# EAGLE design BHOnOfreSquareBoard (EAGLE 8.3.2)
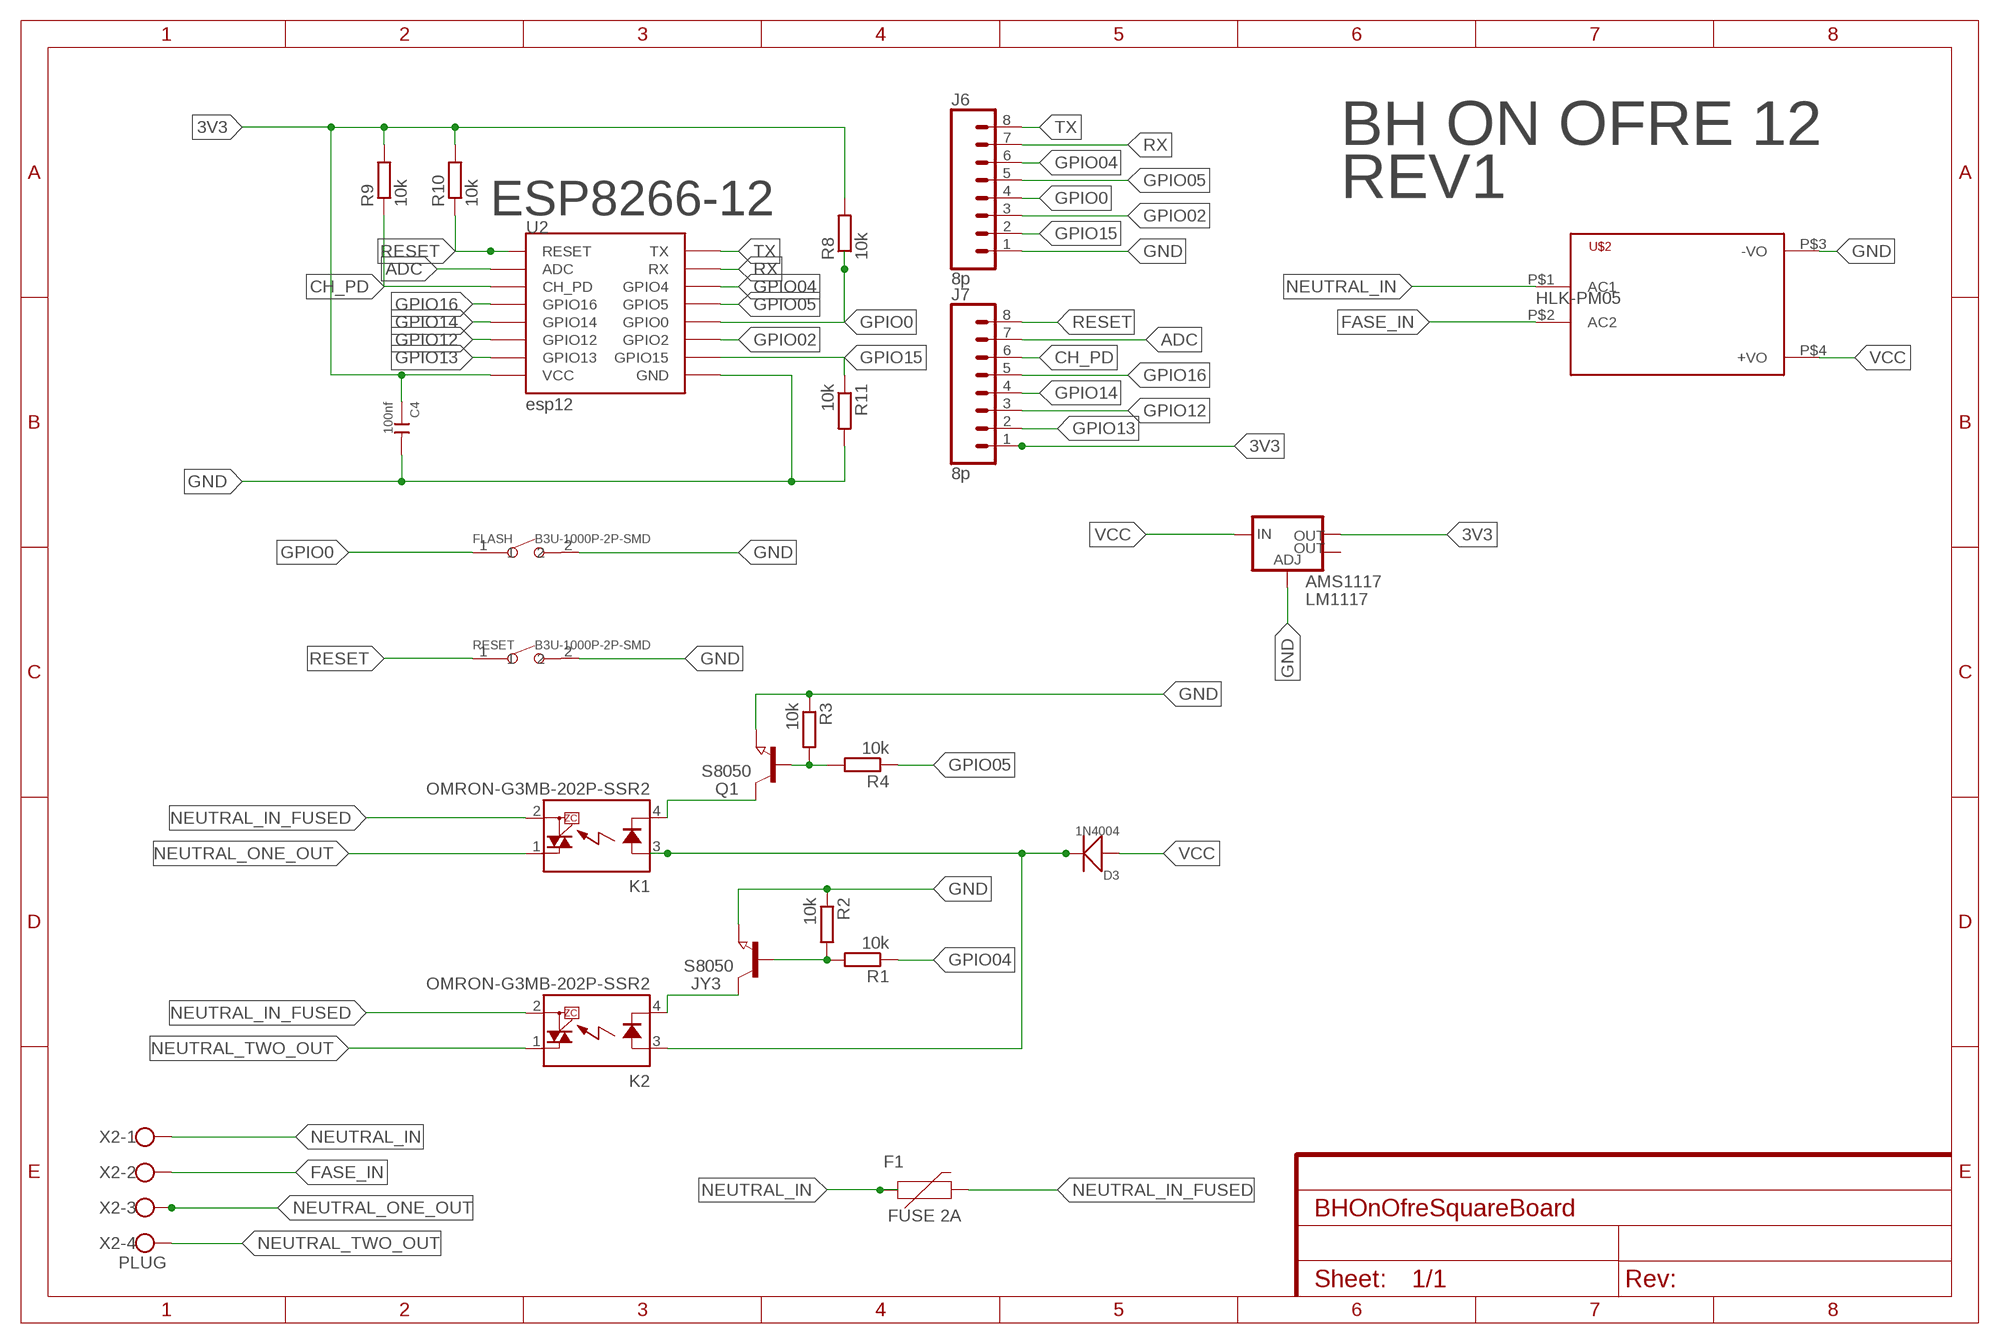
[diagram p0: schematic, sheet 1]

## Parts
AMS1117  LM1117  V_REG_LM1117SOT223  [SOT223]
C4  100nf  CERAMIC-100NF-50V-10%-X7R(0805)  [C0805]
D3  1N4004  DIODE-GEN-PURPOSE-1KV-1A(DO-214AC)  [DO-214AC]
F1  FUSE 2A  PPTC_PTH  [PTH]
FLASH  B3U-1000P-2P-SMD  SMD-BUTTON(2P-3.0X2.5X1.2+0.4MM)-B3U-1000P-2P-SMD  [SW2-2.6-3.0X2.5X1.2+0.4MM]
J6  8p  CONN_08"  [1X08]
J7  8p  CONN_08"  [1X08]
JY3  S8050  NPN-TRANSISTOR_SOT23  [SOT23]
K1  OMRON-G3MB-202P-SSR2  [OMRON-G3MB-202P-SSR]
K2  OMRON-G3MB-202P-SSR2  [OMRON-G3MB-202P-SSR]
Q1  S8050  NPN-TRANSISTOR_SOT23  [SOT23]
R1  10k  R-EU_R0603  [R0603]
R2  10k  R-EU_R0603  [R0603]
R3  10k  R-EU_R0603  [R0603]
R4  10k  R-EU_R0603  [R0603]
R8  10k  R-EU_R0603  [R0603]
R9  10k  R-EU_R0603  [R0603]
R10  10k  R-EU_R0603  [R0603]
R11  10k  R-EU_R0603  [R0603]
RESET  B3U-1000P-2P-SMD  SMD-BUTTON(2P-3.0X2.5X1.2+0.4MM)-B3U-1000P-2P-SMD  [SW2-2.6-3.0X2.5X1.2+0.4MM]
U2  esp12  ESP12SMD  [ESP12-SMD]
U$2  HKLPM01  [HKLPM01]
X2  PLUG  W237-4  [W237-4]

## Nets
3V3: AMS1117.2(OUT) C4.1 J7.1 R8.2 R9.2 R10.2 U2.VCC
ADC: J7.7 U2.ADC
CH_PD: J7.6 R9.1 U2.CH_PD
FASE_IN [220V]: U$2.P$2(AC2) X2.2
GND: AMS1117.1(ADJ) C4.2 FLASH.2 J6.1 JY3.2(E) Q1.2(E) R2.1 R3.1 R11.2 RESET.2 U2.GND U$2.P$3(-VO)
GPIO0: FLASH.1 J6.4 R8.1 U2.GPIO0
GPIO02: J6.3 U2.GPIO2
GPIO04: J6.6 R1.1 U2.GPIO4
GPIO05: J6.5 R4.1 U2.GPIO5
GPIO12: J7.3 U2.GPIO12
GPIO13: J7.2 U2.GPIO13
GPIO14: J7.4 U2.GPIO14
GPIO15: J6.2 R11.1 U2.GPIO15
GPIO16: J7.5 U2.GPIO16
N$1: K1.4(K) Q1.3(C)
N$2: D3.2(-) K1.3(A) K2.3(A)
N$7: Q1.1(B) R3.2 R4.2
N$9: JY3.3(C) K2.4(K)
N$13: JY3.1(B) R1.2 R2.2
NEUTRAL_IN [220V]: F1.P$1 U$2.P$1(AC1) X2.1
NEUTRAL_IN_FUSED: F1.P$2 K1.2(DS2) K2.2(DS2)
NEUTRAL_ONE_OUT [220V]: K1.1(DS1) X2.3
NEUTRAL_TWO_OUT [220V]: K2.1(DS1) X2.4
RESET: J7.8 R10.1 RESET.1 U2.RESET
RX: J6.7 U2.RXD0(RX)
TX: J6.8 U2.TXD0(TX)
VCC: AMS1117.3(IN) D3.1(+) U$2.P$4(+VO)
Unconnected: AMS1117.4(OUT)

## Notes on the sheet
- BH ON OFRE 12
- REV1
- ESP8266-12
- HLK-PM05

## Library data of the parts
AMS1117 = SparkFun-IC-Power:V_REG_LM1117: Voltage Regulator LM1117 Standard adjustable voltage regulator but in SMD form. Spark Fun Electronics SKU : COM-00595; PROD_ID: VREG-08170
C4 = Seeed-Capacitor:CERAMIC-100NF-50V-10%-X7R(0805): 302010165; MPN: CC0805KRX7R9BB104
D3 = Seeed-Diode:DIODE-GEN-PURPOSE-1KV-1A(DO-214AC): 304010013; MPN: 1N4007; VALUE: 1N4007
F1 = SparkFun-Fuses:PPTC: Resettable Fuse PPTC Resettable Fuse. Really a sort of resistor with a polymeric positive temperature coefficient whose resistance increases dramatically with an increase in temperature. When heated by the power passing through the resistance rises causing the current to be limited, protecting the circuit. This is achieved by the transition of the polymer from a crystalline to an amorphous state where the conductive carbon separates breaking the conductive pathways found in the cool crystalline structure. When a PPTC cools back down it resumes conducting letting the circuit turn back on. SparkFun Products: SparkFun RedBoard - Programmed with Arduino <https://www.sparkfun.com/products/12757> Pro Micro - 5V/16MHz <https://www.sparkfun.com/products/12640> Arduino Pro 328 - 5V/16MHz <https://www.sparkfun.com/products/10915> MP3 Trigger <https://www.sparkfun.com/products/13720>; PROD_ID: RES-08490; VALUE: 72V/0.25A
FLASH RESET = Seeed-Switch:SMD-BUTTON(2P-3.0X2.5X1.2+0.4MM): 311020047; MPN: B3U-1000P-2P-SMD
J6 J7 = SparkFun-Connectors:CONN_08: Multi connection point. Often used as Generic Header-pin footprint for 0.1 inch spaced/style header connections On any of the 0.1 inch spaced packages, you can populate with these: Break Away Headers - Straight <https://www.sparkfun.com/products/116> (PRT-00116) Break Away Male Headers - Right Angle <https://www.sparkfun.com/products/553> (PRT-00553) Female Headers <https://www.sparkfun.com/products/115> (PRT-00115) Break Away Headers - Machine Pin <https://www.sparkfun.com/products/117> (PRT-00117) Break Away Female Headers - Swiss Machine Pin <https://www.sparkfun.com/products/743> (PRT-00743) Arduino Stackable Header - 8 Pin <https://www.sparkfun.com/products/9279> (PRT-09279) For SCREWTERMINALS and SPRING TERMINALS visit here: Screw Terimnals on SparkFun.com <https://www.sparkfun.com/search/results?term=Screw+Terminals> (5mm/3.5mm/2.54mm spacing) This device is also useful as a general connection point to wire up your design to another part of your project. Our various solder wires solder well into these plated through hole pads. Hook-Up Wire - Assortment (Stranded, 22 AWG) <https://www.sparkfun.com/products/11375> (PRT-11375) Hook-Up Wire - Assortment (Solid Core, 22 AWG) <https://www.sparkfun.com/products/11367> (PRT-11367) View the entire wire category on our website here <https://www.sparkfun.com/categories/141> Special notes: Molex polarized connector foot print use with SKU : PRT-08231 with associated crimp pins and housings. 1MM SMD Version SKU: PRT-10208 NOTES ON THE VARIANTS LOCK and LOCK_LONGPADS... This footprint was designed to help hold the alignment of a through-hole component (i.e. 6-pin header) while soldering it into place. You may notice that each hole has been shifted either up or down by 0.005 of an inch from it's more standard position (which is a perfectly straight line). This slight alteration caused the pins (the squares in the middle) to touch the edges of the holes. Because they are alternating, it causes a "brace" to hold the component in place. 0.005 has proven to be the perfect amount of "off-center" position when using our standard breakaway headers. Although looks a little odd when you look at the bare footprint, once you have a header in there, the alteration is very hard to notice. Also,if you push a header all the way into place, it is covered up entirely on the bottom side.; PROD_ID: CONN-08438
JY3 Q1 = semicon-smd-ipc:NPN-TRANSISTOR_: NPN TRANSISTOR
K1 K2 = Omron G3MB 202p SSR:OMRON-G3MB-202P-SSR: IT(rms) 8A, Zero Cross type SIP 4pin Triac output SSR Source: http://sharp-world.com/products/device/lineup/data/pdf/datasheet/s102s02_e.pdf; MPN: S202S02F; OC_FARNELL: 1618475; OC_NEWARK: 14N9588
R1-R4 R8-R11 = resistor:R-EU_: RESISTOR, European symbol
U2 = esp8266modules:ESP12: ESP8266 Wifi module 12
U$2 = HKLPM01:HKLPM01
X2 = con-wago-500:W237-4: WAGO SCREW CLAMP; OC_FARNELL: unknown; OC_NEWARK: unknown

## Net classes
1 220V: width 1.27 mm, clearance 1 mm

## Board
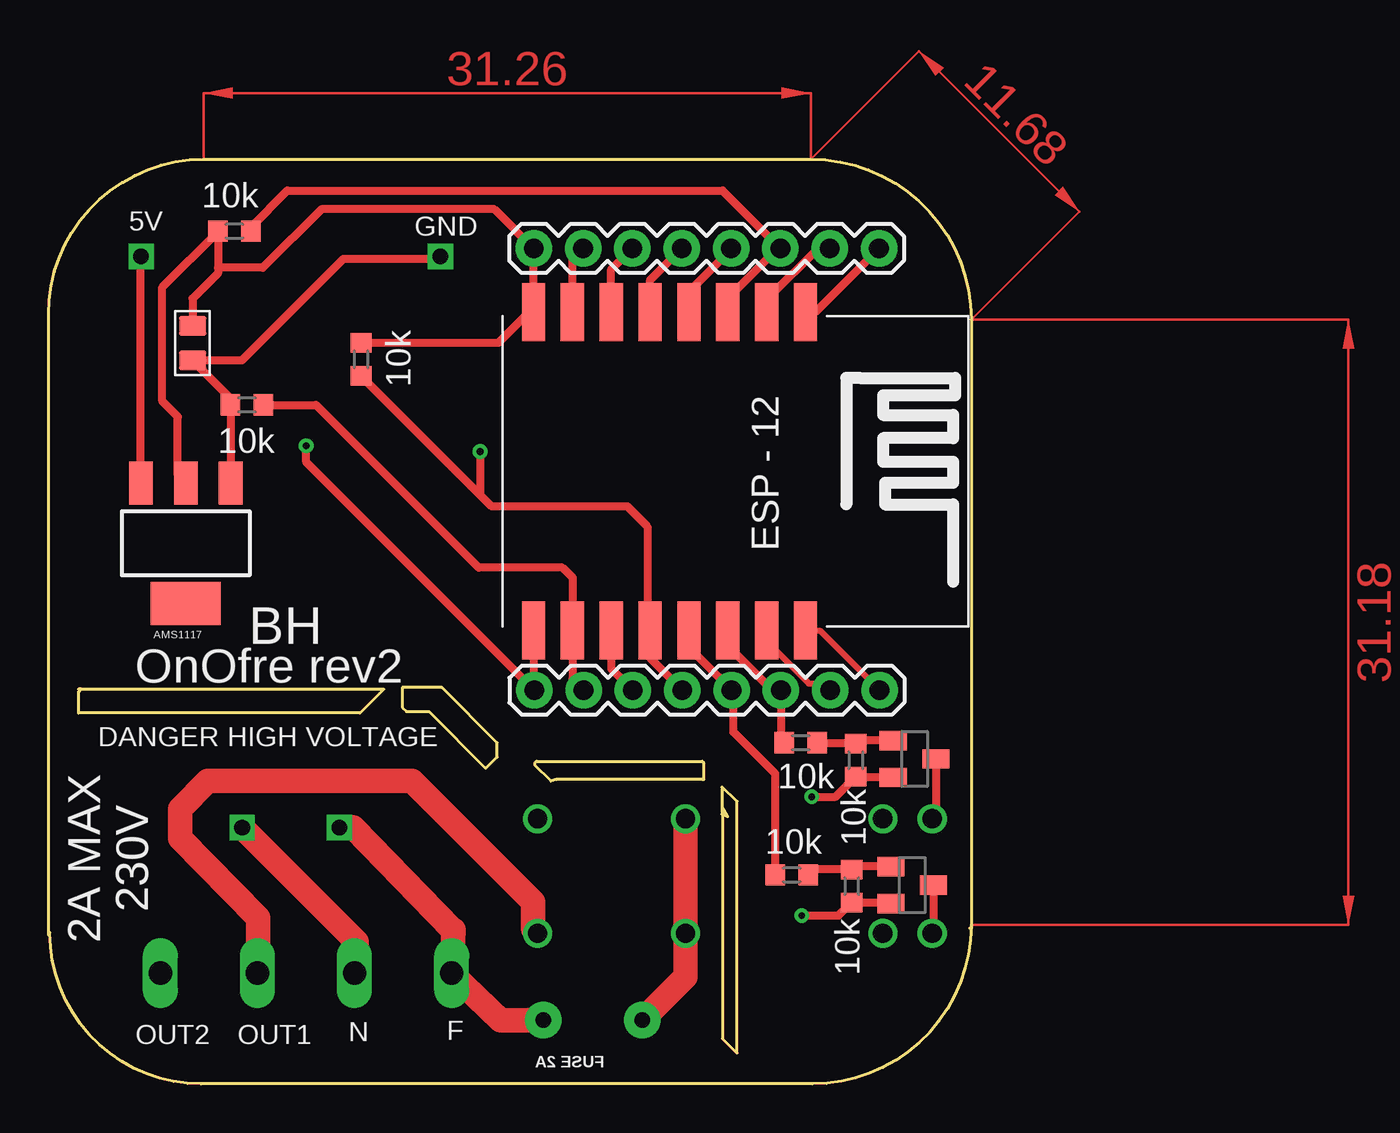
[diagram p1: board, top side]
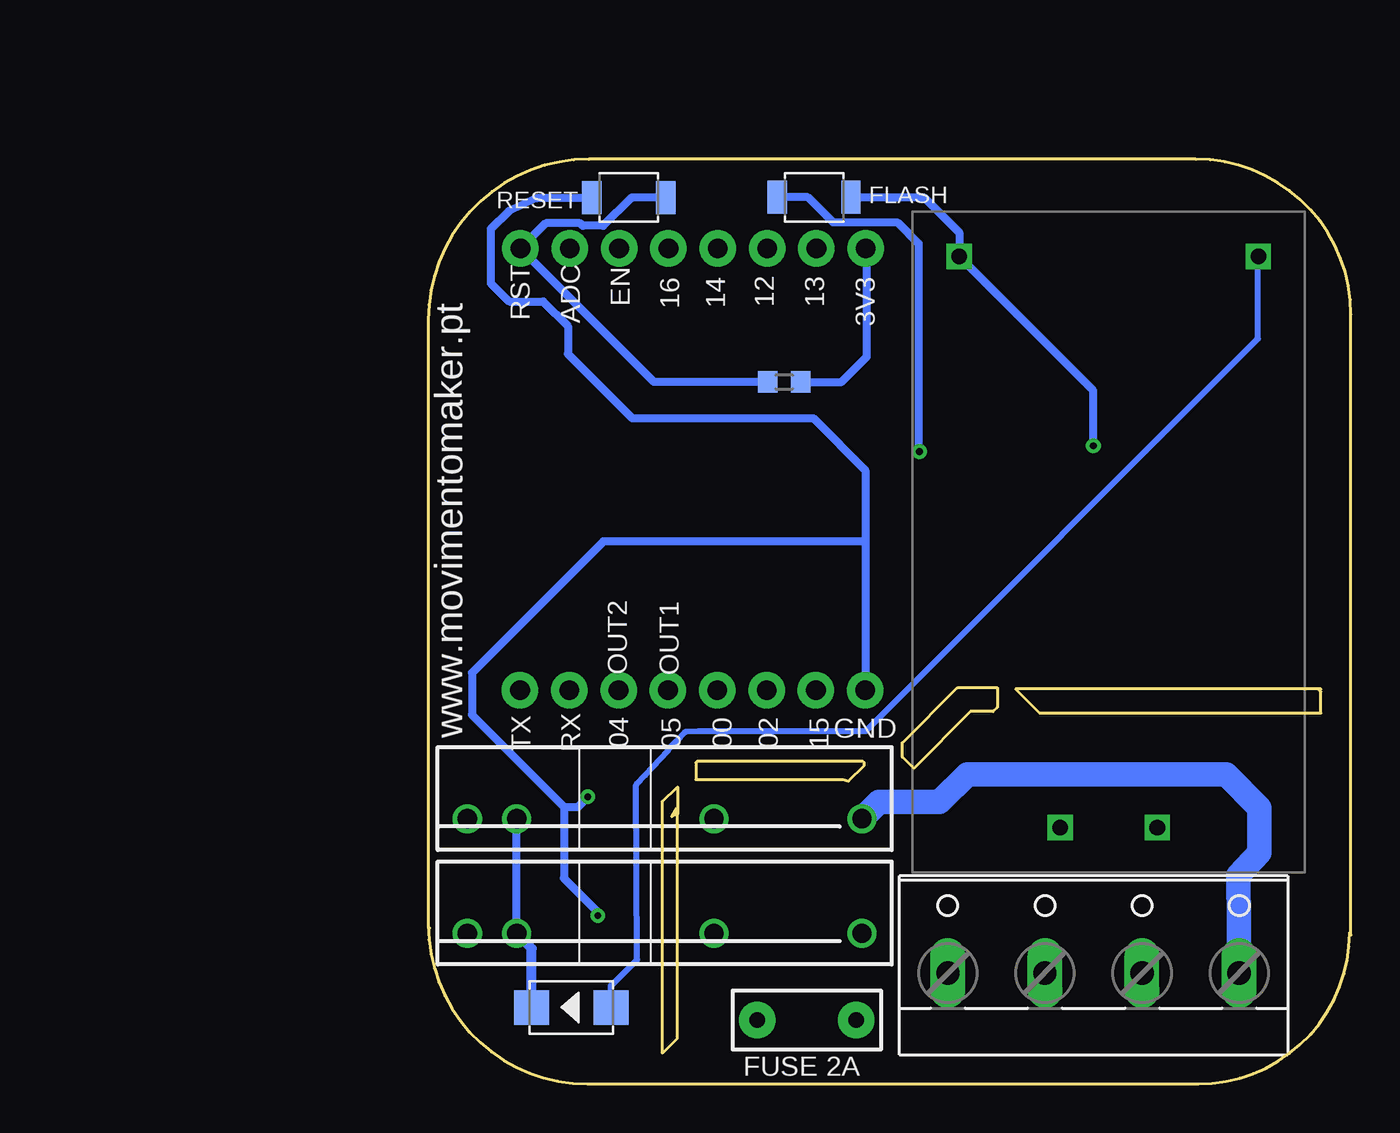
[diagram p2: board, bottom side, seen from below]

Size 47.51 x 47.62 mm. Coordinates in mm from the lower left corner, seen from the top.
Outline: 47.47,8 47.44,8.03
Outline: 0,7.66 0,39.63 arc-90 7.98,47.62 39.25,47.62 arc-90 47.51,39.36 47.51,8.18 arc-90 39.32,0 7.86,0 arc-90 0.07,7.79
Copper layers (1*16): Top 0.035mm / dielectric 1.5mm / Bottom 0.035mm
Design rules "default": minimum track width 6mil, minimum drill 0.35mm, track to track 6mil, track to pad 6mil, pad to pad 6mil, via to via 6mil, smd to smd 6mil, copper to edge 40mil, drill to drill 6mil, minimum pad ring 10mil, minimum via ring 8mil, stop-mask expansion 4mil, vias tented up to drill 0mil, thermal gap 10mil

### Footprints (pad centres in the part's own frame; a part is rotated, then mirrored left to right if it is on the bottom)
SOT223 = smd 1.219 x 2.235: 1 -2.311,-3.099; 2 0,-3.099; 3 2.311,-3.099 | smd 3.6 x 2.2: 4 0,3.099
C0805 = smd 1.397 x 1.016: 1 0,0.889; 2 0,-0.889
DO-214AC = smd 1.8 x 1.77: 1 -2.042,0; 2 2.042,0
PTH = drill 0.8 pad 1.88: P$1 -2.54,0; P$2 2.54,0
SW2-2.6-3.0X2.5X1.2+0.4MM = smd 1 x 1.7: 1 -1.9,0; 2 1.9,0
1X08 = drill 1.016 pad 1.88: 1 0,0; 2 2.54,0; 3 5.08,0; 4 7.62,0; 5 10.16,0; 6 12.7,0; 7 15.24,0; 8 17.78,0
SOT23 = smd 1 x 1.4: 1 -0.95,-1.1; 2 0.95,-1.1; 3 0,1.1
OMRON-G3MB-202P-SSR = drill 1: 1 -12.7,0; 2 -5.08,0; 3 5.08,0; 4 7.62,0
R0603 = smd 1 x 1.1: 1 -0.85,0; 2 0.85,0
ESP12-SMD = smd 3 x 1.2: ADC -8.3,3.8; CH_PD -8.3,1.8; GND 8.1,-8.2; GPIO0 8.1,-2.2; GPIO2 8.1,-4.2; GPIO4 8.1,1.8; GPIO5 8.1,-0.2; GPIO12 -8.3,-4.2; GPIO13 -8.3,-6.2; GPIO14 -8.3,-2.2; GPIO15 8.1,-6.2; GPIO16 -8.3,-0.2; RESET -8.3,5.8; RXD0 8.1,3.8; TXD0 8.1,5.8; VCC -8.3,-8.2
HKLPM01 = drill 0.8 square: P$1 -14.7,2.5; P$2 -14.7,-2.5; P$3 14.7,7.7; P$4 14.7,-7.7
W237-4 = drill 1.194 long: 1 -7.5,-1.27; 2 -2.5,-1.27; 3 2.5,-1.27; 4 7.5,-1.27

### Placement (x,y rotation side)
AMS1117  7.07,27.84 180 top
C4  7.42,38.15 0 top
D3  40.14,3.94 180 bottom
F1  28.02,3.29 180 bottom
FLASH  27.64,45.66 0 bottom
J6  25.01,20.28 0 top
J7  24.98,43.02 0 top
JY3  44.59,16.74 270 top
K1  37.88,7.75 180 bottom
K2  37.88,13.65 180 bottom
Q1  44.47,10.24 270 top
R1  38.72,17.57 0 top
R2  41.56,16.68 90 top
R3  41.36,10.19 90 top
R4  38.27,10.77 0 top
R8  16.09,37.31 90 top
R9  9.57,43.91 180 top
R10  29.19,36.15 0 bottom
R11  10.21,34.97 180 top
RESET  37.18,45.65 180 bottom
U2  33.17,31.45 270 top
U$2  12.47,27.91 90 bottom
X2  13.26,6.98 0 bottom

### Tracks (layer width: path | path; a pad name or v marks a point on that pad's centre or on a via)
3V3
  Top 0.406: 7.33,31.7 7.07,31.43 AMS1117.2 6.65,31.36 6.65,34.36 5.85,35.16 5.85,41.02 8.72,43.89 R9.2 8.72,42.02 | 24.97,39.99 U2.VCC | 24.97,39.99 J7.1 22.96,45.04 14.05,45.04 11.03,42.02 8.72,42.02 | R8.2 23.15,38.16 24.97,39.99 | 8.72,42.02 8.72,41.75 7.42,40.45 C4.1
  Bottom 0.406: R10.2 26.22,36.15 24.92,37.45 24.92,42.96 J7.1
ADC
  Top 0.406: J7.7 39.61,43.02 37.07,40.48 37.07,39.17 37.07,39.65 U2.ADC
CH_PD
  Top 0.406: R9.1 10.42,44.13 12.29,46 34.7,46 J7.6 37.53,43.02 35.11,40.6 35.11,39.89 U2.CH_PD
FASE_IN
  Top 1.27: U$2.P$2 15.87,7.31 X2.2
GND  (via drill 0.35)
  Top 0.406: AMS1117.1 9.38,34.95 R11.2 9.36,35.32 C4.2 9.95,37.26 15.17,42.48 20.04,42.48 U$2.P$3 | U2.GND 25.01,23.31 J6.1 13.27,32.02 v13.27,32.86 | JY3.2 41.6,15.79 R2.1 40.52,14.79 v39.29,14.79 | Q1.2 43.31,9.34 R3.1 40.68,8.67 v38.78,8.67
  Bottom 0.406: 24.96,20.32 J6.1 25,27.94 | 25,27.94 25,31.6 27.68,34.28 37,34.28 40.32,37.59 40.32,39.01 41.59,40.29 43.34,40.29 44.29,41.23 44.29,44.02 43.35,44.95 41.95,45.61 39.12,45.61 RESET.2 | FLASH.2 21.99,45.66 20.17,43.84 U$2.P$3 13.27,35.7 v13.27,32.86 | 25,27.94 38.49,27.94 45.26,21.16 45.26,19.01 40.53,14.28 | 40.53,14.28 39.8,14.28 v39.29,14.79 | 40.53,14.28 40.53,10.6 38.67,8.74 38.74,8.67 v38.78,8.67
GPIO0  (via drill 0.35)
  Top 0.406: 30.97,22.94 U2.GPIO0 | 30.97,22.94 30.97,21.93 J6.4 | 30.97,22.94 30.84,23.07 30.84,28.7 29.8,29.73 22.82,29.73 22.22,30.33 | 22.22,30.33 R8.1 | v22.22,32.57 22.22,30.33
  Bottom 0.406: v22.22,32.57 22.26,32.6 22.26,43.27 23.35,44.37 26.66,44.37 27.96,45.66 FLASH.1
GPIO02
  Top 0.406: U2.GPIO2 28.97,21.39 J6.3
GPIO04
  Top 0.406: U2.GPIO4 34.97,22.56 36.91,20.62 37.36,20.62 J6.6 37.71,17.74 R1.1
GPIO05
  Top 0.406: U2.GPIO5 32.97,22.47 J6.5 35.31,20.14 35.26,20.09 35.26,18.12 37.42,15.97 R4.1
GPIO12
  Top 0.406: U2.GPIO12 28.97,41.93 J7.3
GPIO13
  Top 0.406: U2.GPIO13 26.97,42.47 J7.2
GPIO14
  Top 0.406: U2.GPIO14 30.97,41.39 J7.4
GPIO15
  Top 0.406: R11.1 13.77,34.97 22.15,26.59 26.46,26.59 26.98,26.07 26.98,24.04 U2.GPIO15 26.97,20.85 J6.2
GPIO16
  Top 0.406: J7.5 35.14,42.95 32.88,40.69 32.88,39.25 32.88,39.65 U2.GPIO16
N$1
  Top 0.406: Q1.3 45.57,7.82 K1.4
N$2
  Bottom 0.406: K1.3 K2.3
  Bottom 0.508: D3.2 42.18,6.98 K1.3
N$7
  Top 0.406: Q1.1 41.51,11.19 R3.2 39.39,11.04 R4.2
N$9
  Top 0.406: JY3.3 45.69,13.84 K2.4
N$13
  Top 0.406: JY3.1 41.72,17.69 R2.2 39.62,17.53 R1.2
NEUTRAL_IN
  Top 1.27: U$2.P$1 15.68,13.21 20.81,7.92 20.87,7.92 X2.1 23.28,3.29 F1.P$1
NEUTRAL_IN_FUSED
  Top 1.27: F1.P$2 32.8,5.53 K1.2 K2.2
NEUTRAL_ONE_OUT
  Top 1.27: X2.3 10.79,8.55 6.77,12.65 6.77,14.16 8.2,15.59 18.72,15.59 24.94,9.37 24.94,7.99 K1.1
NEUTRAL_TWO_OUT
  Bottom 1.27: X2.4 5.79,10.75 4.72,11.9 4.72,14.23 6.43,15.94 19.76,15.94 21.18,14.51 24.32,14.51 K2.1
RESET
  Top 0.406: U2.RESET 39.49,39.75 J7.8
  Bottom 0.406: R10.1 35.88,36.15 J7.8 41.47,44.32 39.68,44.32 39.55,44.19 38.5,44.19 37.04,45.65 RESET.1
RX
  Top 0.305: U2.RXD0 36.97,22.8 39.15,20.62 39.9,20.62 J6.7
TX
  Top 0.305: U2.TXD0 39.72,23.35 J6.8
VCC
  Top 0.406: AMS1117.3 4.76,42.59 U$2.P$4
  Bottom 0.305: D3.1 38.1,5.05 36.76,6.4 36.8,15.4 36.78,15.43 36.78,15.46 36.34,15.9 35.16,17.19 35.16,17.22 34.72,17.66 34.3,18.12 34.26,18.12 34.24,18.15 33.62,18.17 24.98,18.17 4.79,38.37 4.79,42.59 U$2.P$4
(copper drawn outside any net)
  shapes: Top area x3

### Text on the board
tNames: 5V | GND | BH | OnOfre rev2 | DANGER HIGH VOLTAGE | 230V | 2A MAX | OUT2 | OUT1 | N | F
bNames: 13 | 12 | 14 | 16 | EN | 3V3 | ADC | RST | OUT1 | OUT2 | GND | 15 | 02 | 00 | 05 | 04 | RX | TX | www.movimentomaker.pt | FUSE 2A